# EAGLE design MHM01 (EAGLE 7.6.0)
CNAME: MHM01 board; CREVISION: 01
Assembly variants: Standalone, Sensor platform
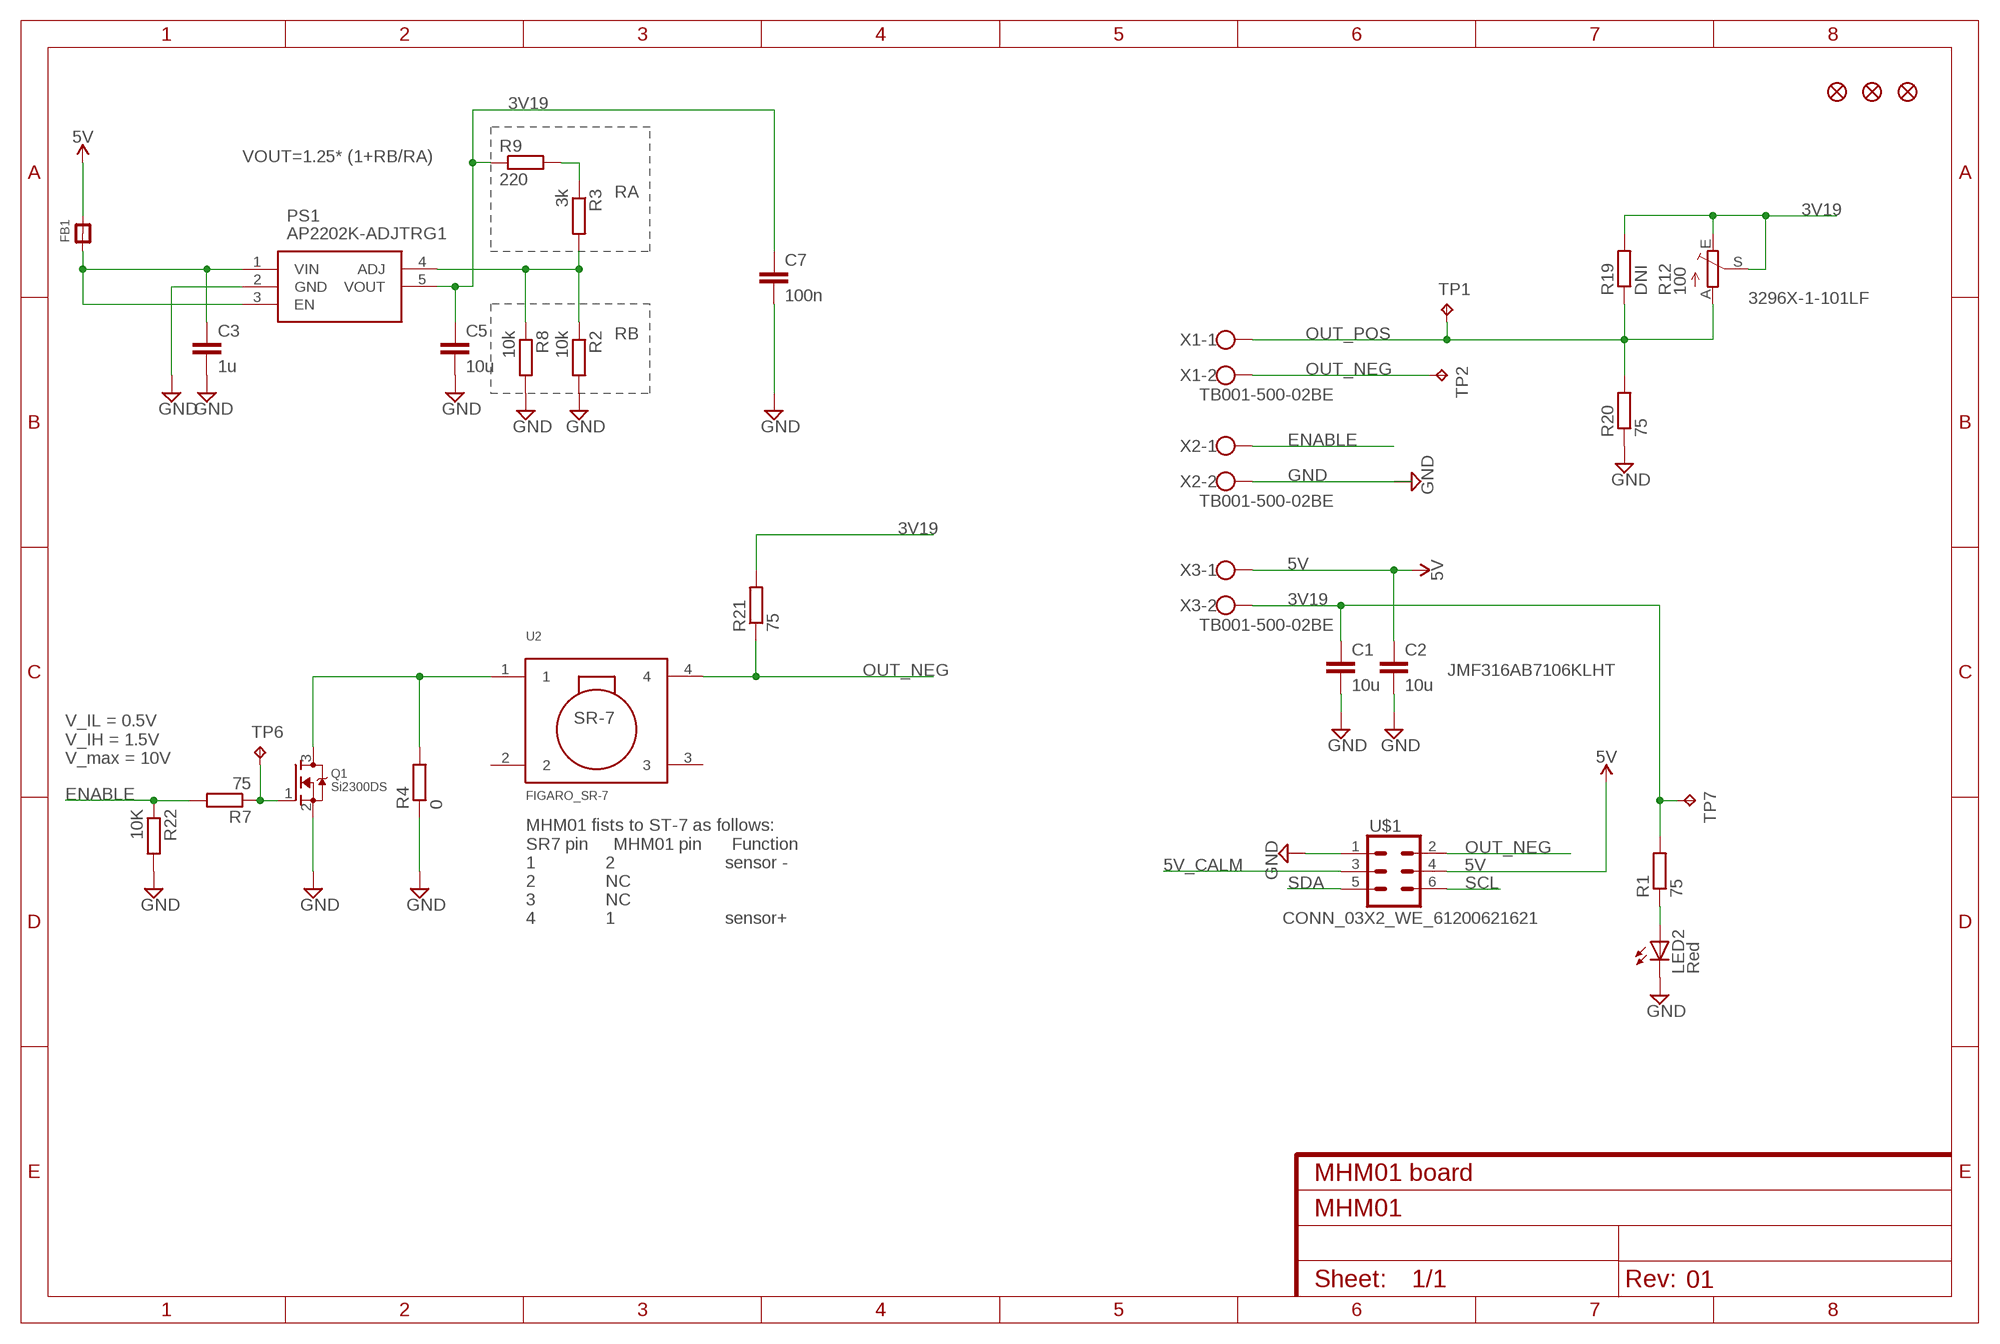
[diagram p0: schematic, sheet 1]

## Parts
C1  10u  C-EUC1206  [C1206]
C2  10u  C-EUC1206  [C1206]  (not fitted in variant Standalone)
C3  1u  C-EUC0603K  [C0603K]  (not fitted in variant Standalone)
C5  10u  C-EUC0603K  [C0603K]  (not fitted in variant Standalone)
C7  100n  C-EUC0603K  [C0603K]  (not fitted in variant Standalone)
FB1  FERRITE  [0603]  (not fitted in variant Standalone)
FID1  FIDUCIAL""  [FIDUCIAL_1MM]
FID2  FIDUCIAL""  [FIDUCIAL_1MM]
FID4  FIDUCIAL""  [FIDUCIAL_1MM]
LED2  Red  LEDCHIPLED_1206  [CHIPLED_1206]
PS1  AP2202K-ADJTRG1  [SOT95P280X145-5N]  (not fitted in variant Standalone)
Q1  Si2300DS  MOSFET-NREFLOW  [SOT23]  (not fitted in variant Sensor platform)
R1  75  R-EU_R1206  [R1206]
R2  10k  R-EU_R0603  [R0603]  (not fitted in variant Standalone)
R3  3k  R-EU_R0603  [R0603]  (not fitted in variant Standalone)
R4  0  R-EU_R1206  [R1206]  (not fitted in variant Standalone)
R7  75  R-EU_R1206  [R1206]  (not fitted in variant Sensor platform)
R8  10k  R-EU_R0603  [R0603]  (not fitted in variant Standalone)
R9  220  R-EU_R0603  [R0603]  (not fitted in variant Standalone)
R12  100  TRIM_EU-RJ9W  [RJ9W]  (not fitted in variant Sensor platform)
R19  DNI  R-EU_R1206  [R1206]  (not fitted in variant Standalone)  (not fitted in variant Sensor platform)
R20  75  R-EU_R1206  [R1206]  (not fitted in variant Sensor platform)
R21  75  R-EU_R1206  [R1206]
R22  10K  R-EU_R1206  [R1206]  (not fitted in variant Sensor platform)
TP1  TPTP10R  [TP10R]
TP2  TPTP10R  [TP10R]
TP6  TPTP10R  [TP10R]
TP7  TPTP10R  [TP10R]
U2  FIGARO_SR-7  [FIGARO-SR7]
U$1  CONN_03X2_WE_61200621621  [WE_61200621621]  (not fitted in variant Standalone)
X1  TB001-500-02BE  W237-102  [W237-102]  (not fitted in variant Sensor platform)
X2  TB001-500-02BE  W237-102  [W237-102]  (not fitted in variant Sensor platform)
X3  TB001-500-02BE  W237-102  [W237-102]  (not fitted in variant Sensor platform)

## Nets
3V19: C1.1 C5.1 C7.1 PS1.5(VOUT) R1.2 R9.1 R12.E R12.S R19.2 R21.2 TP7.TP X3.2
5V: C2.1 FB1.2 U$1.4 X3.1
5V_CALM: U$1.3
ENABLE: R7.2 R22.1 X2.1
GND: C1.2 C2.2 C3.2 C5.2 C7.2 LED2.C PS1.2(GND) Q1.2(S) R2.2 R4.1 R8.2 R20.1 R22.2 U$1.1 X2.2
N$1: LED2.A R1.1
N$2: PS1.4(ADJ) R2.1 R3.2 R8.1
N$3: C3.1 FB1.1 PS1.1(VIN) PS1.3(EN)
N$4: Q1.3(D) R4.2 U2.1
N$6: R3.1 R9.2
N$9: Q1.1(G) R7.1 TP6.TP
OUT_NEG: R21.1 TP2.TP U2.4 U$1.2 X1.2
OUT_POS: R12.A R19.1 R20.2 TP1.TP X1.1
SCL: U$1.6
SDA: U$1.5
Unconnected: U2.2 U2.3

## Notes on the sheet
- VOUT=1.25* (1+RB/RA)
- RA
- 3296X-1-101LF
- RB
- JMF316AB7106KLHT
- V_IL = 0.5V
  V_IH = 1.5V
  V_max = 10V
- MHM01 fists to ST-7 as follows:
  SR7 pin     MHM01 pin      Function
  1              2                      sensor -
  2              NC
  3              NC
  4              1                      sensor+

## Library data of the parts
C1 C2 = rcl:C-EU: CAPACITOR, European symbol; PARTNO: JMF316AB7106KLHT
C3 = resistor:C-EU: CAPACITOR, European symbol; PARTNO: GRM188R71C105KE15D
C5 = resistor:C-EU: CAPACITOR, European symbol; PARTNO: GRM188R61A106KE69J
C7 = resistor:C-EU: CAPACITOR, European symbol; PARTNO: CC0603KRX7R8BB104
FB1 = microbuilder:FERRITE: Ferrite Bead 0603 MMZ1608B121C - 120 Ohm @ 100MHz, 600mA, 0.15 Ohm DC Resistance - Digikey: 445-2164-1-ND BK1608HW121-T - 120 Ohm, 600mA Ferrite Chip - Digikey: 587-1876-2-ND 0805 HZ0805B272R-10 - 2.7K Ohm @ 100MHz, 200mA, 0.8 Ohm DC Resistance - Digikey: 240-2504-1-ND (see also Murata BLM21BD272SN1L) MMZ2012Y152B - 1.5K Ohm @ 100MHz, 500mA, 0.4 Ohm DC Resistance - Digikey: 445-1560-1-ND - Mainly for high frequency (80-400MHz) MMZ2012R102A - 1K Ohm @ 100MHz, 500mA, 0.3 Ohm DC Resistance - Digikey: 445-1555-2-ND - More general purpose (10-200MHz); PARTNO: BLM18PG121SN1D
FID1 FID2 FID4 = microbuilder:FIDUCIAL: Fiducial Alignment Points Various fiducial points for machine vision alignment.
LED2 = adafruit:LED: LED OSRAM: - CHIPLED LG R971, LG N971, LY N971, LG Q971, LY Q971, LO R971, LY R971 LH N974, LH R974 LS Q976, LO Q976, LY Q976 LO Q996 - Hyper CHIPLED LW Q18S LB Q993, LB Q99A, LB R99A - SideLED LS A670, LO A670, LY A670, LG A670, LP A670 LB A673, LV A673, LT A673, LW A673 LH A674 LY A675 LS A676, LA A676, LO A676, LY A676, LW A676 LS A679, LY A679, LG A679 - Hyper Micro SIDELED® LS Y876, LA Y876, LO Y876, LY Y876 LT Y87S - SmartLED LW L88C, LW L88S LB L89C, LB L89S, LG L890 LS L89K, LO L89K, LY L89K LS L896, LA L896, LO L896, LY L896 - TOPLED LS T670, LO T670, LY T670, LG T670, LP T670 LSG T670, LSP T670, LSY T670, LOP T670, LYG T670 LG T671, LOG T671, LSG T671 LB T673, LV T673, LT T673, LW T673 LH T674 LS T676, LA T676, LO T676, LY T676, LB T676, LH T676, LSB T676, LW T676 LB T67C, LV T67C, LT T67C, LS T67K, LO T67K, LY T67K, LW E67C LS E67B, LA E67B, LO E67B, LY E67B, LB E67C, LV E67C, LT E67C LW T67C LS T679, LY T679, LG T679 LS T770, LO T770, LY T770, LG T770, LP T770 LB T773, LV T773, LT T773, LW T773 LH T774 LS E675, LA E675, LY E675, LS T675 LS T776, LA T776, LO T776, LY T776, LB T776 LHGB T686 LT T68C, LB T68C - Hyper Mini TOPLED® LB M676 - Mini TOPLED Santana® LG M470 LS M47K, LO M47K, LY M47K Source: http://www.osram.convergy.de/; PARTNO: BR1101W-TR
PS1 = SamacSys_Parts:AP2202K-ADJTRG1: DiodesZetex AP2202K-ADJTRG1, Low Noise LDO Voltage Regulator, Adjustable 150mA, 2.3 13.2 V +/-2%, 5-Pin SOT-23 Source: Datasheet <https://componentsearchengine.com/Datasheets/1/AP2202K-ADJTRG1.pdf>; DESCRIPTION: DiodesZetex AP2202K-ADJTRG1, Low Noise LDO Voltage Regulator, Adjustable 150mA, 2.3 13.2 V +/-2%, 5-Pin SOT-23; HEIGHT: 1.45mm; MANUFACTURER_NAME: Diodes Inc.; MANUFACTURER_PART_NUMBER: AP2202K-ADJTRG1; MOUSER_PART_NUMBER: 621-AP2202K-ADJTRG1; MOUSER_PRICE-STOCK: https://www.mouser.com/Search/Refine.aspx?Keyword=621-AP2202K-ADJTRG1; PARTNO: AP2202K-ADJTRG1
Q1 = adafruit:MOSFET-N: N-Channel Mosfet 2N7002E - 60V 260mA SOT23 [Digikey: 2N7002ET1GOSTR-ND] - REEL BSH103 - 30V 850mA SOT23 [Digikey: 568-5013-1-ND]; PARTNO: JMF316AB7106KLHT
R1 R7 R20 R21 = rcl:R-EU_: RESISTOR, European symbol; PARTNO: CRCW120675R0FKEA
R2 R8 = resistor:R-EU_: RESISTOR, European symbol; PARTNO: CRCW060310K0FKEA
R3 = resistor:R-EU_: RESISTOR, European symbol; PARTNO: ERA-3AEB302V
R4 = rcl:R-EU_: RESISTOR, European symbol; PARTNO: CRCW12060000Z0EA
R9 = resistor:R-EU_: RESISTOR, European symbol; PARTNO: CRCW0603220RFKEA
R12 = pot:TRIM_EU-: POTENTIOMETER; PARTNO: 3296X-1-101LF
R19 = rcl:R-EU_: RESISTOR, European symbol
R22 = rcl:R-EU_: RESISTOR, European symbol; PARTNO: CRCW120610K0FKEA
TP1 TP2 TP6 TP7 = testpad:TP: Test pad
U2 = FRA_eagle_lib:FIGARO_SR-7; PARTNO: SR-7
U$1 = FRA_eagle_lib:CONN_03X2_WE_61200621621: https://eu.mouser.com/ProductDetail/Wurth-Elektronik/61200621621?qs=sGAEpiMZZMs%252BGHln7q6pm%2FFhW%252BtWvhAgbNxkR%252BlwXp8Ip%2FAN9J9VOg%3D%3D https://eu.mouser.com/datasheet/2/445/6120xx21621-265830.pdf; PARTNO: 61200621621
X1-X3 = con-wago-500:W237-102: WAGO SCREW CLAMP; MPN: 237-102; OC_FARNELL: unknown; OC_NEWARK: 70K9898; PARTNO: TB001-500-02BE

## Board
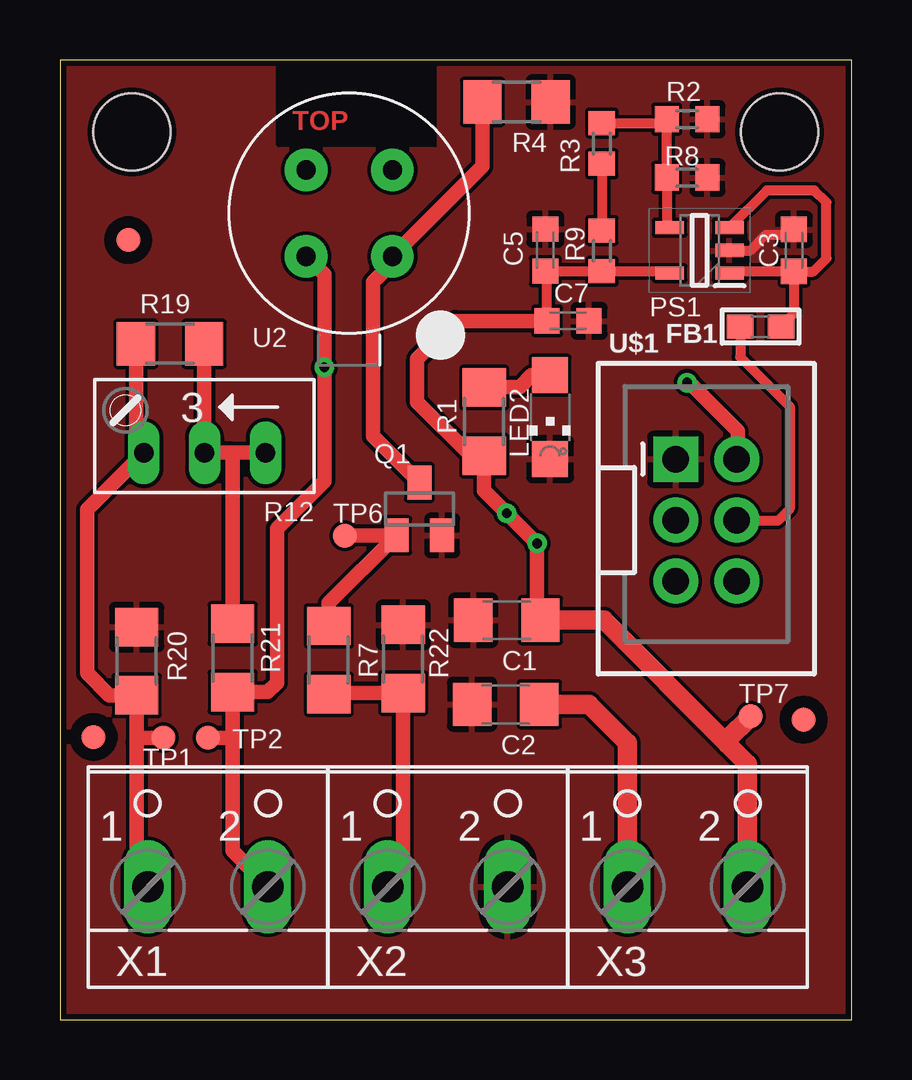
[diagram p1: board, top side]
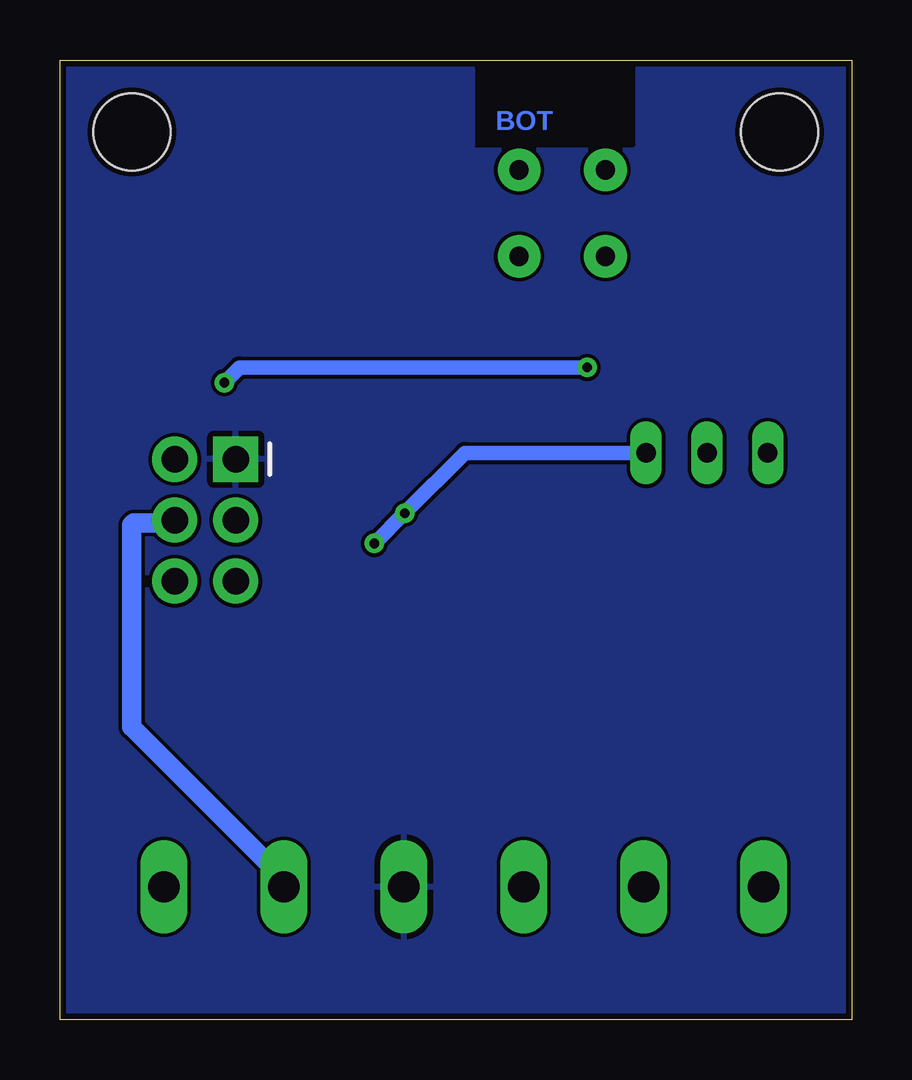
[diagram p2: board, bottom side, seen from below]

Size 33 x 40 mm. Coordinates in mm from the lower left corner, seen from the top.
Outline: 0,0 33,0 33,40 0,40 0,0
Copper layers (1*16): Top 0.035mm / dielectric 1.6mm / Bottom 0.035mm
Design rules "AllPCB": minimum track width 6mil, minimum drill 0.399mm, track to track 0.149859375mm, track to pad 0.149859375mm, pad to pad 8mil, via to via 17mil, smd to smd 6mil, copper to edge 10mil, drill to drill 24mil, minimum pad ring 10mil, minimum via ring 8mil, stop-mask expansion 4mil, vias tented up to drill 0.3mm, thermal gap 10mil
Holes 3.2 mm at 3,37 30,37
tRestrict: area 39.9,21.6 to 40.1,22.2; area 42.7,21.6 to 42.9,22.4; area 9,36.4 to 15.7,39.7
bRestrict: area 9,36.4 to 15.7,39.7

### Footprints (pad centres in the part's own frame; a part is rotated, then mirrored left to right if it is on the bottom)
C1206 = smd 1.6 x 1.8: 1 -1.4,0; 2 1.4,0
C0603K = smd 1.05 x 1.08: 1 -0.875,0; 2 0.875,0
0603 = smd 1.1 x 1: 1 -0.85,0; 2 0.85,0
FIDUCIAL_1MM = smd 1 x 1: 1 0,0
CHIPLED_1206 = smd 1.5 x 1.5: A 0,-1.75; C 0,1.75
SOT95P280X145-5N = smd 1.2 x 0.55: 1 -1.25,0.95; 2 -1.25,0; 3 -1.25,-0.95; 4 1.25,-0.95; 5 1.25,0.95
SOT23 = smd 1 x 1.4: 1 -0.95,-1.1; 2 0.95,-1.1; 3 0,1.1
R1206 = smd 1.6 x 1.803: 1 -1.422,0; 2 1.422,0
R0603 = smd 1 x 1.1: 1 -0.85,0; 2 0.85,0
RJ9W = drill 0.813 long: A 2.54,0.635; E -2.54,0.635; S 0,0.635
TP10R = smd 1 x 1: TP 0,0
FIGARO-SR7 = drill 0.8 pad 1.778: 1 -1.8,1.8; 2 -1.8,-1.8; 3 1.8,-1.8; 4 1.8,1.8
WE_61200621621 = drill 1.1 pad 1.88 square: 1 -1.27,2.54 | drill 1.1 pad 1.88: 2 1.27,2.54; 3 -1.27,0; 4 1.27,0; 5 -1.27,-2.54; 6 1.27,-2.54
W237-102 = drill 1.3 long: 1 -2.5,-1.27; 2 2.5,-1.27

### Placement (x,y rotation side)
C1  18.63,16.65 180 top
C2  18.59,13.14 180 top
C3  30.6,32.06 90 top
C5  20.23,32.07 90 top
C7  21.18,29.12 0 top
FB1  29.2,28.89 180 top
FID1  2.85,32.49 0 top
FID2  1.4,11.78 0 top
FID4  31,12.5 0 top
LED2  20.43,25.11 180 top
PS1  26.66,32.06 180 top
Q1  14.98,21.29 0 top
R1  17.68,24.93 270 top
R2  26.15,37.53 0 top
R3  22.59,36.52 90 top
R4  19.04,38.25 180 top
R7  11.21,14.98 270 top
R8  26.14,35.1 0 top
R9  22.59,32.04 90 top
R12  6.03,24.25 180 top
R19  4.59,28.17 0 top
R20  3.19,14.94 270 top
R21  7.2,15.07 90 top
R22  14.31,15.03 90 top
TP1  4.32,11.74 0 top
TP2  6.17,11.74 0 top
TP6  11.88,20.16 0 top
TP7  28.8,12.64 0 top
U2  12.06,33.62 180 top
U$1  26.94,20.82 0 top
X1  6.17,6.8 0 top
X2  16.16,6.8 0 top
X3  26.16,6.8 0 top

### Tracks (layer width: path | path; a pad name or v marks a point on that pad's centre or on a via)
3V19  (via drill 0.4 pad 0.81)
  Top 0.406: PS1.5 25.34,31.19 R9.1 C5.1 20.31,31.12 C7.1
  Top 0.61: C1.1 19.89,16.79 v19.89,19.84 17.68,22.05 R1.2 17.13,23.51 14.89,25.74 14.89,27.54 16.47,29.11 20.3,29.11 C7.1 | R21.2 7.2,23.55 7.11,23.64 | R19.2 6.01,23.64 | 6.01,23.64 R12.S | 6.01,23.64 7.11,23.64 | 7.11,23.64 8.55,23.64 R12.E
  Top 0.813: C1.1 22.68,16.65 27.83,11.5 | 27.83,11.5 28.66,10.66 X3.2 | TP7.TP 27.83,11.68 27.83,11.5
  Bottom 0.61: v19.89,19.84 v18.63,21.11 16.11,23.62 R12.E
5V
  Top 0.406: FB1.2 28.36,27.62 30.42,25.56 30.42,21.29 29.93,20.79 28.24,20.79 U$1.4
  Top 0.813: C2.1 22.05,13.14 23.66,11.53 X3.1
  Bottom 0.813: U$1.4 28.33,20.7 29.93,20.7 30.02,20.61 30.02,12.2 23.66,5.84 X3.1
ENABLE
  Top 0.61: R7.2 11.25,13.61 R22.1 14.31,6.17 X2.1
GND
  Top 0.406: PS1.2 28.78,32.06 29.43,32.72 30.38,32.72 C3.2
  Top 0.813: 17.23,13.19 C2.2
  pour Top: 34.52,40.86 -0.98,40.23 -1.84,-1.75 33.84,-1.67
  pour Bottom: 33.66,-1.22 -1.07,-0.9 -1.07,40.63 33.88,40.81
N$1
  Top 0.61: LED2.A 19.66,26.86 19.17,26.37 17.7,26.37 R1.1
N$2
  Top 0.406: 25.43,33.03 PS1.4 25.3,33.13 R8.1 R2.1 25.14,37.38 R3.2
N$3
  Top 0.406: C3.1 27.99,31.19 PS1.1 | C3.1 31.41,31.19 31.95,31.73 31.95,34.06 31.45,34.56 29.46,34.56 PS1.3 | C3.1 30.6,29.43 FB1.1
N$4
  Top 0.61: Q1.3 13.05,24.32 13.05,30.73 13.86,31.55 U2.1 17.61,35.57 R4.2
N$6
  Top 0.406: R3.1 R9.2
N$9
  Top 0.61: R7.1 11.21,17.36 Q1.1 11.9,20.18 TP6.TP
OUT_NEG  (via drill 0.4 pad 0.81)
  Top 0.61: 7.2,11.79 R21.1 8.66,13.65 9.04,14.04 9.04,20.48 11.03,22.45 v11.03,27.18 11.03,31.05 U2.4 | 7.2,11.79 7.2,7.04 X1.2 | TP2.TP 7.16,11.74 7.2,11.79 | U$1.2 28.26,23.4 28.26,24.52 26.23,26.55 v26.14,26.55
  Bottom 0.61: v26.14,26.55 25.52,27.18 v11.03,27.18
OUT_POS
  Top 0.61: 3.19,11.56 R20.2 2.05,13.52 1.12,14.45 1.12,21.25 R12.A 3.17,23.94 R19.1 | 3.19,11.56 3.19,6.04 X1.1 | TP1.TP 3.38,11.74 3.19,11.56

### Text on the board
Top: TOP
Bottom: BOT
tDocu: MHM01 v1 | OUT+ OUT- | EN GND | 5-12V 3.19V